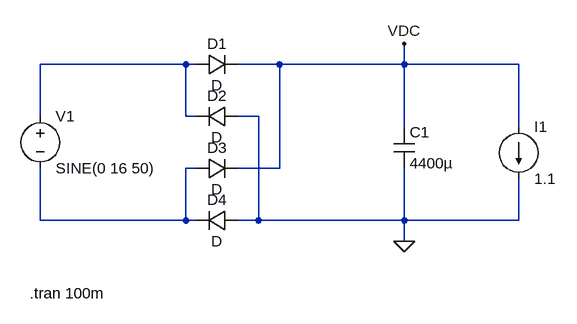
[diagram p0: schematic Rectifier.asc]
Rectifier.asc, the LTspice schematic file:
Version 4
SHEET 1 992 680
WIRE 416 -32 192 -32
WIRE 432 -32 416 -32
WIRE 560 -32 496 -32
WIRE 752 -32 752 -64
WIRE 752 -32 560 -32
WIRE 928 -32 752 -32
WIRE 192 48 192 -32
WIRE 416 48 416 -32
WIRE 432 48 416 48
WIRE 528 48 496 48
WIRE 752 64 752 -32
WIRE 928 64 928 -32
WIRE 432 128 416 128
WIRE 560 128 560 -32
WIRE 560 128 496 128
WIRE 192 208 192 128
WIRE 416 208 416 128
WIRE 416 208 192 208
WIRE 432 208 416 208
WIRE 528 208 528 48
WIRE 528 208 496 208
WIRE 752 208 752 128
WIRE 752 208 528 208
WIRE 928 208 928 144
WIRE 928 208 752 208
WIRE 752 240 752 208
FLAG 752 240 0
FLAG 752 -64 VDC
SYMBOL voltage 192 32 R0
WINDOW 123 0 0 Left 0
WINDOW 39 0 0 Left 0
SYMATTR InstName V1
SYMATTR Value SINE(0 16 50)
SYMBOL diode 432 -16 R270
WINDOW 0 32 32 VTop 2
WINDOW 3 0 32 VBottom 2
SYMATTR InstName D1
SYMBOL diode 496 32 R90
WINDOW 0 0 32 VBottom 2
WINDOW 3 32 32 VTop 2
SYMATTR InstName D2
SYMBOL diode 432 144 R270
WINDOW 0 32 32 VTop 2
WINDOW 3 0 32 VBottom 2
SYMATTR InstName D3
SYMBOL diode 496 192 R90
WINDOW 0 0 32 VBottom 2
WINDOW 3 32 32 VTop 2
SYMATTR InstName D4
SYMBOL cap 736 64 R0
SYMATTR InstName C1
SYMATTR Value 4400µ
SYMBOL current 928 64 R0
WINDOW 123 0 0 Left 0
WINDOW 39 0 0 Left 0
SYMATTR InstName I1
SYMATTR Value 1.1
TEXT 176 320 Left 2 !.tran 100m

The netlist it stands for:
* Rectifier.asc
V1 N001 N002 SINE(0 16 50)
D1 N001 VDC D
D2 0 N001 D
D3 N002 VDC D
D4 0 N002 D
C1 VDC 0 4400µ
I1 VDC 0 1.1
.model D D
.lib standard.dio
.tran 100m
.backanno
.end